# Altium schematic sheet ESC.SchDoc
size A3; SheetNumber: 4; SheetTotal: 7
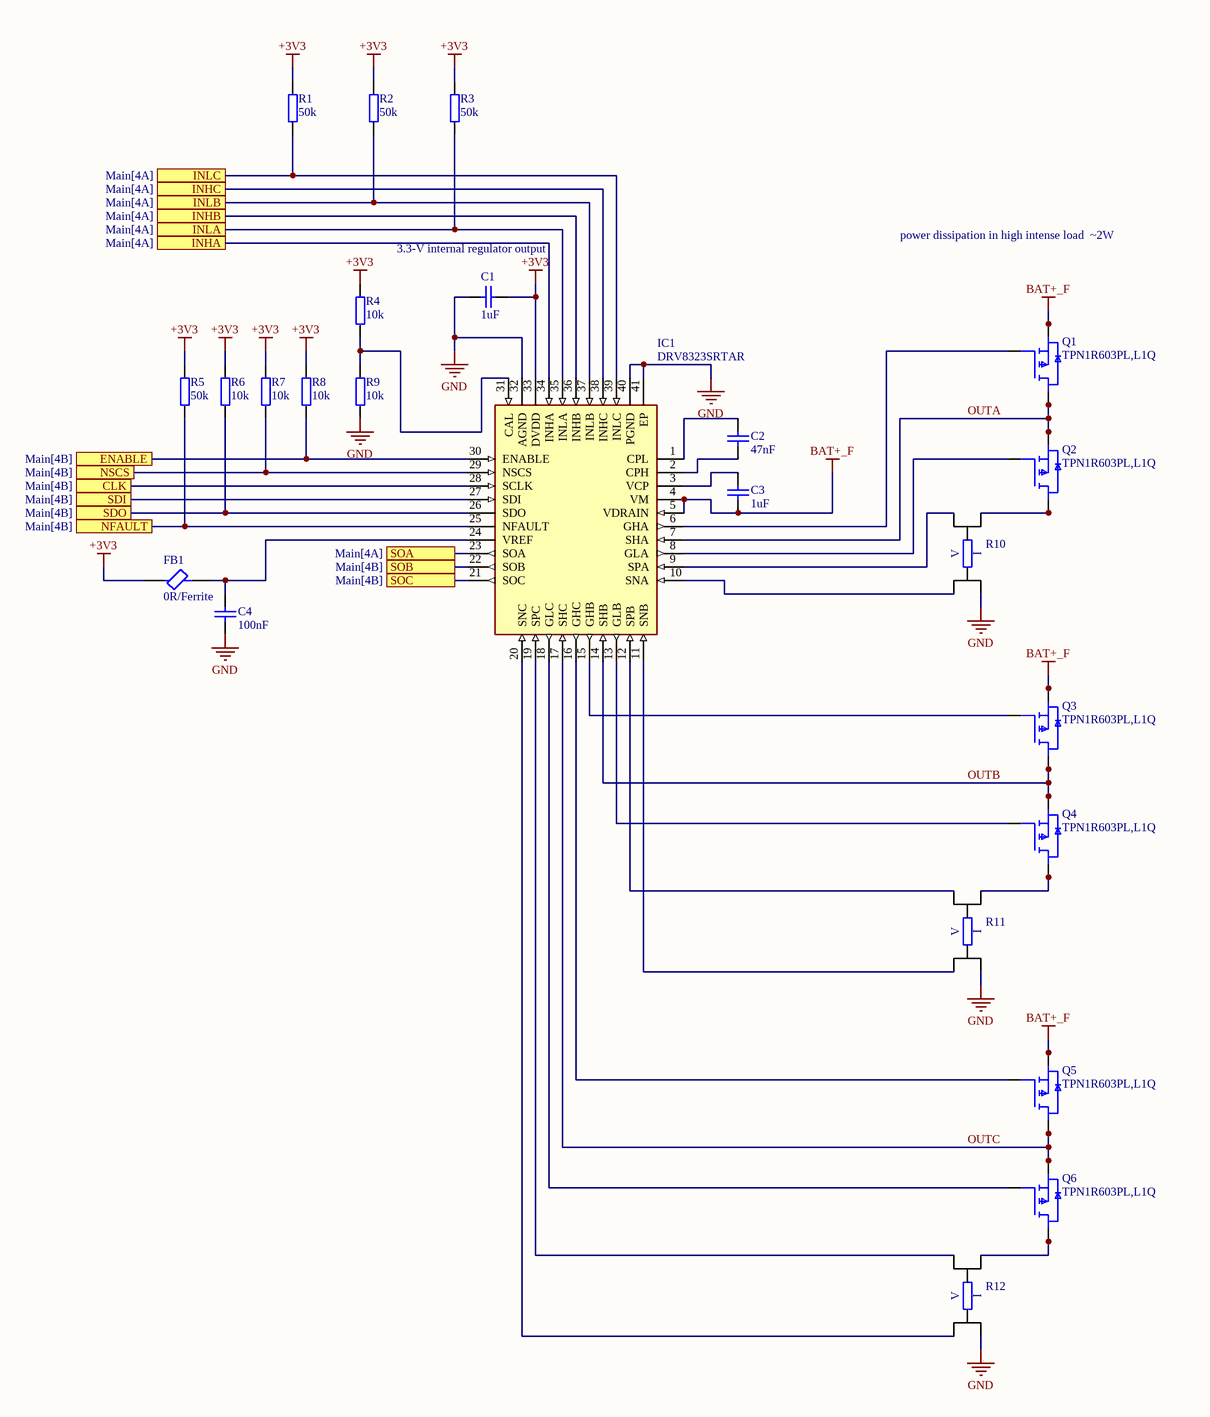
[diagram p0: ESC.SchDoc]

## Parts
C1  value 1uF  [CAP0402]  (hidden comment: Cap0402)
C2  value 47nF  [CAP0603]  (hidden comment: CapSMD0603)
C3  value 1uF  [CAP0603]  (hidden comment: CapSMD0603)
C4  value 100nF  [CAP0402]  (hidden comment: Cap0402)
FB1  0R/Ferrite  [NFZ15SG152SN10B]
IC1  DRV8323SRTAR  [QFN50P600X600X80-41N-D]
Q1  TPN1R603PL,L1Q  [TPN1R603PLL1Q]
Q2  TPN1R603PL,L1Q  [TPN1R603PLL1Q]
Q3  TPN1R603PL,L1Q  [TPN1R603PLL1Q]
Q4  TPN1R603PL,L1Q  [TPN1R603PLL1Q]
Q5  TPN1R603PL,L1Q  [TPN1R603PLL1Q]
Q6  TPN1R603PL,L1Q  [TPN1R603PLL1Q]
R1  value 50k  [RES0402]  (hidden comment: Res0402)
R2  value 50k  [RES0402]  (hidden comment: Res0402)
R3  value 50k  [RES0402]  (hidden comment: Res0402)
R4  value 10k  [RES0402]  (hidden comment: Res0402)
R5  value 50k  [RES0402]  (hidden comment: Res0402)
R6  value 10k  [RES0402]  (hidden comment: Res0402)
R7  value 10k  [RES0402]  (hidden comment: Res0402)
R8  value 10k  [RES0402]  (hidden comment: Res0402)
R9  value 10k  [RES0402]  (hidden comment: Res0402)
R10  WSK12161L000FEA  [WSK12161L000FEA]  (value not drawn)
R11  WSK12161L000FEA  [WSK12161L000FEA]  (value not drawn)
R12  WSK12161L000FEA  [WSK12161L000FEA]  (value not drawn)

## Ports
CLK (see Main[4B]), ENABLE (see Main[4B]), INHA (see Main[4A]), INHB (see Main[4A]), INHC (see Main[4A]), INLA (see Main[4A]), INLB (see Main[4A]), INLC (see Main[4A]), NFAULT (see Main[4B]), NSCS (see Main[4B]), SDI (see Main[4B]), SDO (see Main[4B]), SOA (see Main[4A]), SOB (see Main[4B]), SOC (see Main[4B])

## Nets
+3V3: C1.2 FB1.1 IC1.33(DVDD) R1.2 R2.2 R3.2 R4.2 R5.2 R6.2 R7.2 R8.2
BAT+_F: C3.1 IC1.4(VM) IC1.5(VDRAIN) Q1.1(S_1) Q1.2(S_2) Q1.3(S_3) Q3.1(S_1) Q3.2(S_2) Q3.3(S_3) Q5.1(S_1) Q5.2(S_2) Q5.3(S_3)
GND: C1.1 C4.1 IC1.32(AGND) IC1.40(PGND) IC1.41(EP) R9.1 R10.1 R11.1 R12.1
CLK: IC1.28(SCLK) ; port CLK
ENABLE: IC1.30(ENABLE) R8.1 ; port ENABLE
INHA: IC1.34(INHA) ; port INHA
INHB: IC1.36(INHB) ; port INHB
INHC: IC1.38(INHC) ; port INHC
INLA: IC1.35(INLA) R3.1 ; port INLA
INLB: IC1.37(INLB) R2.1 ; port INLB
INLC: IC1.39(INLC) R1.1 ; port INLC
NFAULT: IC1.25(NFAULT) R5.1 ; port NFAULT
NSCS: IC1.29(NSCS) R7.1 ; port NSCS
OUTA: IC1.7(SHA) Q1.5(D_1) Q1.6(D_2) Q1.7(D_3) Q1.8(D_4) Q1.9(D_4) Q2.1(S_1) Q2.2(S_2) Q2.3(S_3)
OUTB: IC1.14(SHB) Q3.5(D_1) Q3.6(D_2) Q3.7(D_3) Q3.8(D_4) Q3.9(D_4) Q4.1(S_1) Q4.2(S_2) Q4.3(S_3)
OUTC: IC1.17(SHC) Q5.5(D_1) Q5.6(D_2) Q5.7(D_3) Q5.8(D_4) Q5.9(D_4) Q6.1(S_1) Q6.2(S_2) Q6.3(S_3)
SDI: IC1.27(SDI) ; port SDI
SDO: IC1.26(SDO) R6.1 ; port SDO
SOA: IC1.23(SOA) ; port SOA
SOB: IC1.22(SOB) ; port SOB
SOC: IC1.21(SOC) ; port SOC
NetC2_1: C2.1 IC1.2(CPH)
NetC2_2: C2.2 IC1.1(CPL)
NetC3_2: C3.2 IC1.3(VCP)
NetC4_2: C4.2 FB1.2 IC1.24(VREF)
NetIC1_6: IC1.6(GHA) Q1.4(G)
NetIC1_8: IC1.8(GLA) Q2.4(G)
NetIC1_9: IC1.9(SPA) R10.3
NetIC1_10: IC1.10(SNA) R10.2
NetIC1_11: IC1.11(SNB) R11.2
NetIC1_12: IC1.12(SPB) R11.3
NetIC1_13: IC1.13(GLB) Q4.4(G)
NetIC1_15: IC1.15(GHB) Q3.4(G)
NetIC1_16: IC1.16(GHC) Q5.4(G)
NetIC1_18: IC1.18(GLC) Q6.4(G)
NetIC1_19: IC1.19(SPC) R12.3
NetIC1_20: IC1.20(SNC) R12.2
NetIC1_31: IC1.31(CAL) R4.1 R9.2
NetQ2_5: Q2.5(D_1) Q2.6(D_2) Q2.7(D_3) Q2.8(D_4) Q2.9(D_4) R10.4
NetQ4_5: Q4.5(D_1) Q4.6(D_2) Q4.7(D_3) Q4.8(D_4) Q4.9(D_4) R11.4
NetQ6_5: Q6.5(D_1) Q6.6(D_2) Q6.7(D_3) Q6.8(D_4) Q6.9(D_4) R12.4

## Notes on the sheet
- power dissipation in high intense load  ~2W
- 3.3-V internal regulator output
- (near IC1) Separate grounds?
- (in symbol WSK1216L5000FEA) I; V

## Library data of the parts
C1 = Cap0402: Voltage: val
C2 C3 = CapSMD0603: 50V; Published: 8-Jun-2000; LatestRevisionDate: 29-May-2009; LatestRevisionNote: IPC-7351 Footprint Added.; PackageReference: C1206; Publisher: Altium Limited; PackageDescription: Chip Capacitor
C4 = Cap0402: Voltage: 6V3
FB1 = BLM15PE471SH1D: Ferrite Bead; Manufacturer_Name: Murata Electronics; Datasheet Link: https://www.murata.com/en-global/products/productdetail.aspx?cate=luNoiseSupprFilteChipFerriBead&partno=BLM15PE471SH1%23; Height: 0.55mm; Manufacturer_Part_Number: BLM15PE471SH1D; Mouser Part Number: 81-BLM15PE471SH1D; Mouser Price/Stock: https://www.mouser.co.uk/ProductDetail/Murata-Electronics/BLM15PE471SH1D?qs=DRkmTr78QATAY5qAVx1hGA%3D%3D
IC1 = DRV8323SRTAR: Integrated Circuit; Manufacturer_Name: Texas Instruments; Datasheet Link: http://www.ti.com/lit/ds/symlink/drv8323.pdf; Height: 0.8mm; Manufacturer_Part_Number: DRV8323SRTAR; Mouser Part Number: 595-DRV8323SRTAR; Mouser Price/Stock: https://www.mouser.co.uk/ProductDetail/Texas-Instruments/DRV8323SRTAR?qs=u4fy%2FsgLU9P2gpPTX6mffg%3D%3D; Arrow Part Number: DRV8323SRTAR; Arrow Price/Stock: https://www.arrow.com/en/products/drv8323srtar/texas-instruments?utm_currency=USD&region=nac
Q1-Q6 = TPN1R603PL,L1Q: MOSFET (N-Channel); Manufacturer_Name: Toshiba; Datasheet Link: https://toshiba.semicon-storage.com/ap-en/semiconductor/product/mosfets/12v-300v-mosfets/detail.TPN1R603PL.html; Height: 0.9mm; Manufacturer_Part_Number: TPN1R603PL,L1Q; Mouser Part Number: 757-TPN1R603PLL1Q; Mouser Price/Stock: https://www.mouser.co.uk/ProductDetail/Toshiba/TPN1R603PLL1Q?qs=bUPhaerQQeGYpGlYi%252BLguw%3D%3D; Arrow Part Number: TPN1R603PL,L1Q; Arrow Price/Stock: https://www.arrow.com/en/products/tpn1r603pll1q/toshiba?utm_currency=USD&region=nac
R10-R12 = WSK1216L5000FEA: Resistor; Manufacturer_Name: Vishay; Datasheet Link: http://www.vishay.com/docs/30189/wsk1216.pdf; Height: 1.9mm; Manufacturer_Part_Number: WSK1216L5000FEA; Mouser Part Number: 71-WSK1216L5000FEA; Mouser Price/Stock: https://www.mouser.co.uk/ProductDetail/Vishay-Dale/WSK1216L5000FEA?qs=OlC7AqGiEDlM2wGD42LFoQ%3D%3D; Arrow Part Number: WSK1216L5000FEA; Arrow Price/Stock: https://www.arrow.com/en/products/wsk1216l5000fea/vishay?region=nac